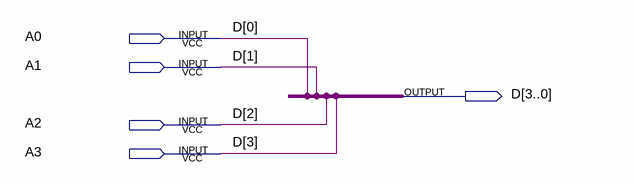
[diagram p0: schematic sheet]
// Quartus schematic adapter_4p_to_bus4b.bdf as structural Verilog: 0 symbols, 5 pins
module adapter_4p_to_bus4b (
  input  A0,
  input  A1,
  input  A2,
  input  A3,
  output [3:0] D
);


  assign D = {A3, A2, A1, A0};
endmodule
